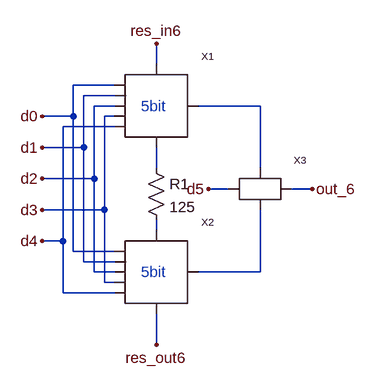
[diagram p0: schematic level5.asc]
level5.asc, the LTspice schematic file:
Version 4
SHEET 1 880 680
WIRE 160 16 160 -16
WIRE 96 48 32 48
WIRE 96 64 48 64
WIRE 96 80 64 80
WIRE 320 80 224 80
WIRE 32 96 32 48
WIRE 32 96 -16 96
WIRE 96 96 80 96
WIRE 96 112 16 112
WIRE 48 144 48 64
WIRE 48 144 -16 144
WIRE 160 176 160 144
WIRE 320 176 320 80
WIRE 64 192 64 80
WIRE 64 192 -16 192
WIRE 272 208 240 208
WIRE 400 208 368 208
WIRE 80 240 80 96
WIRE 80 240 -16 240
WIRE 160 272 160 256
WIRE 16 288 16 112
WIRE 16 288 -16 288
WIRE 32 304 32 96
WIRE 96 304 32 304
WIRE 48 320 48 144
WIRE 96 320 48 320
WIRE 64 336 64 192
WIRE 96 336 64 336
WIRE 320 336 320 240
WIRE 320 336 224 336
WIRE 80 352 80 240
WIRE 96 352 80 352
WIRE 16 368 16 288
WIRE 96 368 16 368
WIRE 160 448 160 400
FLAG -16 96 d0
FLAG -16 144 d1
FLAG -16 192 d2
FLAG -16 240 d3
FLAG -16 288 d4
FLAG 240 208 d5
FLAG 400 208 out_6
FLAG 160 -16 res_in6
FLAG 160 448 res_out6
SYMBOL level4 160 80 R0
SYMATTR InstName X1
SYMBOL level4 160 336 R0
SYMATTR InstName X2
SYMBOL switch 320 208 R0
SYMATTR InstName X3
SYMBOL res 144 160 R0
SYMATTR InstName R1
SYMATTR Value 125
TEXT 136 336 Left 2 ;5bit
TEXT 136 80 Left 2 ;5bit

The netlist it stands for:
* level5.asc
XX1 d0 d1 d2 d3 d4 res_in6 N002 N001 level4  ; pins d0 d1 d2 d3 d4 str_in str_out out_5
XX2 d0 d1 d2 d3 d4 N003 res_out6 N004 level4  ; pins d0 d1 d2 d3 d4 str_in str_out out_5
XX3 d5 N001 N004 out_6 switch  ; pins dig_in in_1 in_2 Vout
R1 N002 N003 125
* 5bit
* 5bit
.backanno
.end